# Altium project doppler.PrjPcb (part 2 of 2)

## Sheet 7_wallfilter.SchDoc
size A; SheetNumber: 7; SheetTotal: 7
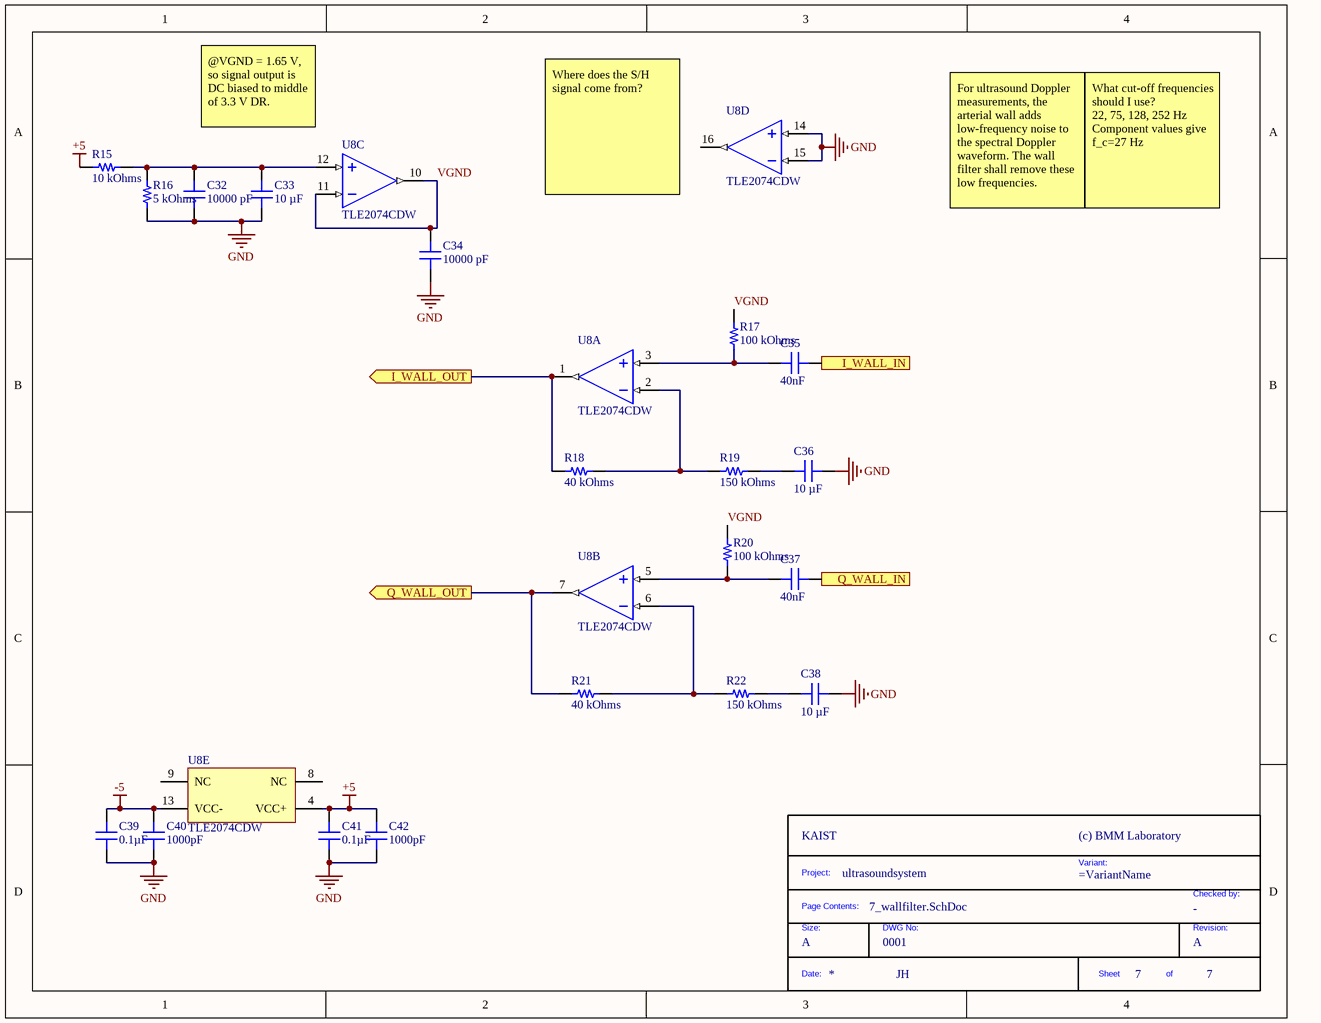
[diagram p4: 7_wallfilter.SchDoc]

### Parts
(Parts that share a designator on the sheet are numbered #1, #2 ... from top to bottom, then left to right.)
*?#5  DWG No: 0001  Size: A  (hidden comment: TitleBlock)  (graphical)
C32  10000 pF  [CAP 1206_3216 - 0.8MM]
C33  10 µF  [CAP 1206_3216 - 0.8MM]
C34  10000 pF  [CAP 1206_3216 - 0.8MM]
C35  40nF  [CAP 1206_3216 - 1.8MM]
C36  10 µF  [CAP 1206_3216 - 0.8MM]
C37  40nF  [CAP 1206_3216 - 1.8MM]
C38  10 µF  [CAP 1206_3216 - 0.8MM]
C39  0.1µF  [CAP 1206_3216 - 1.0MM]
C40  1000pF  [CAP 1206_3216 - 1.2MM]
C41  0.1µF  [CAP 1206_3216 - 1.0MM]
C42  1000pF  [CAP 1206_3216 - 1.2MM]
R15  10 kOhms  [RES 1206_3216]
R16  5 kOhms  [RES 1206_3216]
R17  100 kOhms  [RES 1206_3216]
R18  40 kOhms  [RES 1206_3216]
R19  150 kOhms  [RES 1206_3216]
R20  100 kOhms  [RES 1206_3216]
R21  40 kOhms  [RES 1206_3216]
R22  150 kOhms  [RES 1206_3216]
U8  TLE2074CDW  [DW0016A_M]  (parts A,B,C,D,E of 5)

### Ports
I_WALL_IN (in), I_WALL_OUT (out), Q_WALL_IN (in), Q_WALL_OUT (out)

### Nets
+5: C41.2 C42.2 R15.2 U8.4(VCC+)
-5: C39.2 C40.2 U8.13(VCC-)
GND: C32.1 C33.1 C34.1 C36.1 C38.1 C39.1 C40.1 C41.1 C42.1 R16.2 U8.14(IN4+) U8.15(IN4-)
VGND: C34.2 R17.2 R20.2 U8.10(OUT3) U8.11(IN3-)
NetC32_2: C32.2 C33.2 R15.1 R16.1 U8.12(IN3+)
NetC35_1: C35.1 ; port I_WALL_IN
NetC35_2: C35.2 R17.1 U8.3(IN1+)
NetC36_2: C36.2 R19.1
NetC37_1: C37.1 ; port Q_WALL_IN
NetC37_2: C37.2 R20.1 U8.5(IN2+)
NetC38_2: C38.2 R22.1
NetJ1_9: R18.2 U8.1(OUT1) ; port I_WALL_OUT
NetJ1_10: R21.2 U8.7(OUT2) ; port Q_WALL_OUT
NetR18_1: R18.1 R19.2 U8.2(IN1-)
NetR21_1: R21.1 R22.2 U8.6(IN2-)

Not connected (* = marked no-connect by the designer): U8 8(NC) 9(NC) 16(OUT4)

### Notes on the sheet
- @VGND = 1.65 V, so signal output is DC biased to middle of 3.3 V DR.
- (near U8) Where does the S/H signal come from?
- For ultrasound Doppler measurements, the arterial wall adds low-frequency noise to the spectral Doppler waveform. The wall filter shall remove these low frequencies.
- What cut-off frequencies should I use?
  22, 75, 128, 252 Hz
  Component values give f_c=27 Hz
- (in symbol TitleBlock) Project:; Variant:; Checked by:; Page Contents:; Size:; DWG No:; Revision:; Date:; Sheet; of

### Library data of the parts
*?#5 = TitleBlock: Standard Title Block; Checked by: -
C32 C34 = 1206B103K500CT: CAP CER 10000PF 50V X7R 1206; manufacturer: Walsin Technology Corporation; Tolerance: ±10%; Part Number: 1206B103K500CT; Value: 10000 pF; Applications: General Purpose; Capacitance: 10000 pF; componentlink1description: Datasheet; componentlink1url: http://www.passivecomponent.com/wp-content/uploads/2018/10/MLCC.pdf; componentlink2description: DigiKey Link; componentlink2url: https://www.digikey.com/en/products/detail/walsin-technology-corporation/1206B103K500CT/9355097; Device Package: 1206 (3216 Metric); lastupdated: 2023-04-30 19:15:57; Lifecycle Status: Active; Minimum Order: 1; Mounting Type: Surface Mount, MLCC; Operating Temperature: -55°C ~ 125°C; Package / Case: 1206 (3216 Metric); packaging: TapeAndReel; partid: 19113; Part Status: Active; price: 0.01; series: -; Size / Dimension: 0.126" L x 0.063" W (3.20mm x 1.60mm); Supplier 1: DigiKey; Supplier Part Number 1: 1292-1600-1-ND; Temperature Coefficient: X7R; Thickness (Max): 0.035" (0.90mm); Voltage - Rated: 50V
C33 C36 C38 = GRM31CR71E106KA12K: CAP CER 10UF 25V X7R 1206; manufacturer: Murata Electronics; Tolerance: ±10%; Part Number: GRM31CR71E106KA12K; Value: 10 µF; Applications: General Purpose; Capacitance: 10 µF; componentlink1description: Datasheet; componentlink1url: https://search.murata.co.jp/Ceramy/image/img/A01X/G101/ENG/GRM31CR71E106KA12-01.pdf; componentlink2description: DigiKey Link; componentlink2url: https://www.digikey.com/en/products/detail/murata-electronics/GRM31CR71E106KA12K/4905618; Device Package: 1206 (3216 Metric); lastupdated: 2023-04-30 19:16:01; Lifecycle Status: Active; Minimum Order: 1; Mounting Type: Surface Mount, MLCC; Operating Temperature: -55°C ~ 125°C; Package / Case: 1206 (3216 Metric); packaging: TapeAndReel; partid: 19493; Part Status: Active; price: 0.06; series: GRM; Size / Dimension: 0.126" L x 0.063" W (3.20mm x 1.60mm); Supplier 1: DigiKey; Supplier Part Number 1: 490-14678-1-ND; Temperature Coefficient: X7R; Thickness (Max): 0.071" (1.80mm); Voltage - Rated: 25V
C35 C37 = 12065C474JAT2A: CAP CER 0.47UF 50V X7R 1206; manufacturer: AVX Corporation; Capacitance: 0.47µF; Tolerance: ±5%; Part Number: 12065C474JAT2A; Value: 40nF; Applications: General Purpose; componentlink1description: Datasheet; componentlink1url: http://datasheets.avx.com/X7RDielectric.pdf; componentlink2description: DigiKey Link; componentlink2url: http://digikey.com/product-detail/en/avx-corporation/12065C474JAT2A/478-5784-1-ND/2136376; Device Package: 1206 (3216 Metric); lastupdated: 2020-09-02 01:05:40; Lifecycle Status: Active; Minimum Order: 1; Mounting Type: Surface Mount, MLCC; Operating Temperature: -55°C ~ 125°C; Package / Case: 1206 (3216 Metric); packaging: TapeAndReel; partid: 20070; Part Status: Active; price: 0.08; series: -; Size / Dimension: 0.126" L x 0.063" W (3.20mm x 1.60mm); Supplier 1: DigiKey; Supplier Part Number 1: 478-5784-1-ND; Temperature Coefficient: X7R; Thickness (Max): 0.060" (1.52mm); Voltage - Rated: 50V
C39 C41 = 12065C104JAT2A: CAP CER 0.1UF 50V X7R 1206; manufacturer: AVX Corporation; Tolerance: ±5%; Part Number: 12065C104JAT2A; Value: 0.1µF; Applications: General Purpose; Capacitance: 0.1µF; componentlink1description: Datasheet; componentlink1url: http://datasheets.avx.com/X7RDielectric.pdf; componentlink2description: DigiKey Link; componentlink2url: http://digikey.com/product-detail/en/avx-corporation/12065C104JAT2A/478-3797-1-ND/1116495; Device Package: 1206 (3216 Metric); lastupdated: 2020-09-02 01:05:06; Lifecycle Status: Active; Minimum Order: 1; Mounting Type: Surface Mount, MLCC; Operating Temperature: -55°C ~ 125°C; Package / Case: 1206 (3216 Metric); packaging: TapeAndReel; partid: 19088; Part Status: Active; price: 0.06; series: -; Size / Dimension: 0.126" L x 0.063" W (3.20mm x 1.60mm); Supplier 1: DigiKey; Supplier Part Number 1: 478-3797-1-ND; Temperature Coefficient: X7R; Thickness (Max): 0.037" (0.94mm); Voltage - Rated: 50V
C40 C42 = 12067C102KAT2A: CAP CER 1000PF 500V X7R 1206; manufacturer: AVX Corporation; Tolerance: ±10%; Part Number: 12067C102KAT2A; Value: 1000pF; Applications: General Purpose; Capacitance: 1000pF; componentlink1description: Datasheet; componentlink1url: http://datasheets.avx.com/X7RDielectric.pdf; componentlink2description: DigiKey Link; componentlink2url: http://digikey.com/product-detail/en/avx-corporation/12067C102KAT2A/478-3805-1-ND/1116503; Device Package: 1206 (3216 Metric); lastupdated: 2020-09-02 01:05:09; Lifecycle Status: Active; Minimum Order: 1; Mounting Type: Surface Mount, MLCC; Operating Temperature: -55°C ~ 125°C; Package / Case: 1206 (3216 Metric); packaging: TapeAndReel; partid: 19161; Part Status: Active; price: 0.09; series: -; Size / Dimension: 0.126" L x 0.063" W (3.20mm x 1.60mm); Supplier 1: DigiKey; Supplier Part Number 1: 478-3805-1-ND; Temperature Coefficient: X7R; Thickness (Max): 0.040" (1.02mm); Voltage - Rated: 500V
R15 = CRG1206F10K: RES SMD 10K OHM 1% 1/4W 1206; Manufacturer: TE Connectivity Passive Product; Power (Watts): 0.25W, 1/4W; Temperature Coefficient: ±100ppm/°C; Part Number: CRG1206F10K; ComponentLink1Description: Datasheet; ComponentLink1URL: https://www.te.com/commerce/DocumentDelivery/DDEController?Action=srchrtrv&DocNm=1773204&DocType=DS&DocLang=English; ComponentLink2Description: DigiKey Link; ComponentLink2URL: https://www.digikey.com/en/products/detail/te-connectivity-passive-product/CRG1206F10K/2389909; Composition: Thick Film; Device Package: 1206 (3216 Metric); Height - Seated (Max): 0.026" (0.65mm); LastUpdated: 2023-04-30 19:43:59; Lifecycle Status: Active; Minimum Order: 1; Number of Terminations: 2; Operating Temperature: -55°C ~ 155°C; Package / Case: 1206 (3216 Metric); Packaging: TapeAndReel; PartId: 26989; Part Status: Active; Price: 0.01; Resistance: 10 kOhms; Series: CRG, Neohm; Size / Dimension: 0.122" L x 0.061" W (3.10mm x 1.55mm); Supplier 1: DigiKey; Supplier Part Number 1: A106069CT-ND; Supplier Device Package: 1206; Tolerance: ±1%; Value: 10 kOhms
R16 = RT1206BRD075KL: RES SMD 5K OHM 0.1% 1/4W 1206; Manufacturer: Yageo; Power (Watts): 0.25W, 1/4W; Temperature Coefficient: ±25ppm/°C; Part Number: RT1206BRD075KL; ComponentLink1Description: Datasheet; ComponentLink1URL: https://www.yageo.com/upload/media/product/productsearch/datasheet/rchip/PYu-RT_1-to-0.01_RoHS_L_11.pdf; ComponentLink2Description: DigiKey Link; ComponentLink2URL: https://www.digikey.com/en/products/detail/yageo/RT1206BRD075KL/5936961; Composition: Thin Film; Device Package: 1206 (3216 Metric); Height - Seated (Max): 0.026" (0.65mm); LastUpdated: 2023-04-30 19:43:23; Lifecycle Status: Active; Minimum Order: 1; Number of Terminations: 2; Operating Temperature: -55°C ~ 155°C; Package / Case: 1206 (3216 Metric); Packaging: TapeAndReel; PartId: 33949; Part Status: Active; Price: 0.09; Resistance: 5 kOhms; Series: RT; Size / Dimension: 0.122" L x 0.063" W (3.10mm x 1.60mm); Supplier 1: DigiKey; Supplier Part Number 1: YAG5090CT-ND; Supplier Device Package: 1206; Tolerance: ±0.1%; Value: 5 kOhms
R17 R20 = CRGCQ1206F100K: RES 100K OHM 1% 1/4W 1206; Manufacturer: TE Connectivity Passive Product; Power (Watts): 0.25W, 1/4W; Temperature Coefficient: ±100ppm/°C; Part Number: CRGCQ1206F100K; ComponentLink1Description: Datasheet; ComponentLink1URL: https://www.te.com/commerce/DocumentDelivery/DDEController?Action=srchrtrv&DocNm=1773204-3&DocType=DS&DocLang=English; ComponentLink2Description: DigiKey Link; ComponentLink2URL: https://www.digikey.com/en/products/detail/te-connectivity-passive-product/CRGCQ1206F100K/8576436; Composition: Thick Film; Device Package: 1206 (3216 Metric); Features: Automotive AEC-Q200, Moisture Resistant; Height - Seated (Max): 0.026" (0.65mm); LastUpdated: 2023-04-30 19:43:59; Lifecycle Status: Active; Minimum Order: 1; Number of Terminations: 2; Operating Temperature: -55°C ~ 155°C; Package / Case: 1206 (3216 Metric); Packaging: TapeAndReel; PartId: 26994; Part Status: Active; Price: 0.01; Ratings: AEC-Q200; Resistance: 100 kOhms; Series: CRGCQ; Size / Dimension: 0.122" L x 0.061" W (3.10mm x 1.55mm); Supplier 1: DigiKey; Supplier Part Number 1: A129834CT-ND; Supplier Device Package: 1206; Tolerance: ±1%; Value: 100 kOhms
R18 R21 = RT1206BRD0740KL: RES SMD 40K OHM 0.1% 1/4W 1206; Manufacturer: Yageo; Power (Watts): 0.25W, 1/4W; Temperature Coefficient: ±25ppm/°C; Part Number: RT1206BRD0740KL; ComponentLink1Description: Datasheet; ComponentLink1URL: https://www.yageo.com/upload/media/product/productsearch/datasheet/rchip/PYu-RT_1-to-0.01_RoHS_L_12.pdf; ComponentLink2Description: DigiKey Link; ComponentLink2URL: https://www.digikey.com/en/products/detail/yageo/RT1206BRD0740KL/5936957; Composition: Thin Film; Device Package: 1206 (3216 Metric); Height - Seated (Max): 0.026" (0.65mm); LastUpdated: 2023-04-30 19:42:13; Lifecycle Status: Active; Minimum Order: 1; Number of Terminations: 2; Operating Temperature: -55°C ~ 155°C; Package / Case: 1206 (3216 Metric); Packaging: TapeAndReel; PartId: 58355; Part Status: Active; Price: 0.09; Resistance: 40 kOhms; Series: RT; Size / Dimension: 0.122" L x 0.063" W (3.10mm x 1.60mm); Supplier 1: DigiKey; Supplier Part Number 1: 13-RT1206BRD0740KLCT-ND; Supplier Device Package: 1206; Tolerance: ±0.1%; Value: 40 kOhms
R19 R22 = CR1206-FX-1503ELF: RES SMD 150K OHM 1% 1/4W 1206; Manufacturer: Bourns Inc.; Power (Watts): 0.25W, 1/4W; Temperature Coefficient: ±100ppm/°C; Part Number: CR1206-FX-1503ELF; ComponentLink1Description: Datasheet; ComponentLink1URL: https://www.bourns.com/docs/Product-Datasheets/CHPREZTR.pdf; ComponentLink2Description: DigiKey Link; ComponentLink2URL: https://www.digikey.com/en/products/detail/bourns-inc/CR1206-FX-1503ELF/2562775; Composition: Thick Film; Device Package: 1206 (3216 Metric); Features: Moisture Resistant; Height - Seated (Max): 0.030" (0.75mm); LastUpdated: 2023-04-30 19:43:43; Lifecycle Status: Active; Minimum Order: 1; Number of Terminations: 2; Operating Temperature: -55°C ~ 155°C; Package / Case: 1206 (3216 Metric); Packaging: TapeAndReel; PartId: 29549; Part Status: Active; Price: 0.01; Resistance: 150 kOhms; Series: CR1206; Size / Dimension: 0.126" L x 0.063" W (3.20mm x 1.60mm); Supplier 1: DigiKey; Supplier Part Number 1: CR1206-FX-1503ELFCT-ND; Supplier Device Package: 1206; Tolerance: ±1%; Value: 150 kOhms
U8 = CMP-0272-03500-3: Quad Low-Noise High-Speed JFET-Input Operational Amplifier, 4.5 to 38 V, 0 to 70 degC, 16-pin SOIC (DW16), Green (RoHS & no Sb/Br); Manufacturer: Texas Instruments; GBW(Typ)(MHz): 9.4; Number of Channels: 4; Total Supply Voltage(Min)(+5V is 5, +/-5V is 10): 4.5; Slew Rate(Typ)(V/us): 35; Sub Family: High Output Current Amplifier (>=50mA), High Supply Voltage Amplifier (>=30V), Precision Amplifier; IIB(Max)(pA): 175; Vio (25C)(Max)(mV): 5; Iq per channel(Max)(mA): 1.875; Offset Drift(Typ)(uV/C): 10.1; CMRR(Min)(dB): 70; Total Supply Voltage(Max)(+5V is 5, +/-5V is 10): 38; Packing: TUBE; Rating: Catalog; PartNumber: TLE2074CDW; ComponentLink3URL: http://www.ti.com/litv/pdf/msoi003g; Eco-Plan: Green (RoHS & no Sb/Br); PackageDescription: 16-Pin Plastic Small Outline, Body 10.30 x 7.50 mm, Pitch 1.27 mm; Mounting Technology: Surface Mount; Code_JEDEC: MS-013; ComponentLink2URL: http://www.ti.com/lit/ds/symlink/tle2074.pdf; PackageVersion: 4040000-2/G, 01/2011; PackageReference: DW0016A; ComponentLink1URL: http://www.ti.com/; ComponentLink3Description: Package Specification; DatasheetVersion: SLOS181C; ComponentLink1Description: Manufacturer URL; ComponentLink2Description: Datasheet

## Sheet 3_bp_filter.SchDoc
size A; SheetNumber: 4; SheetTotal: 7
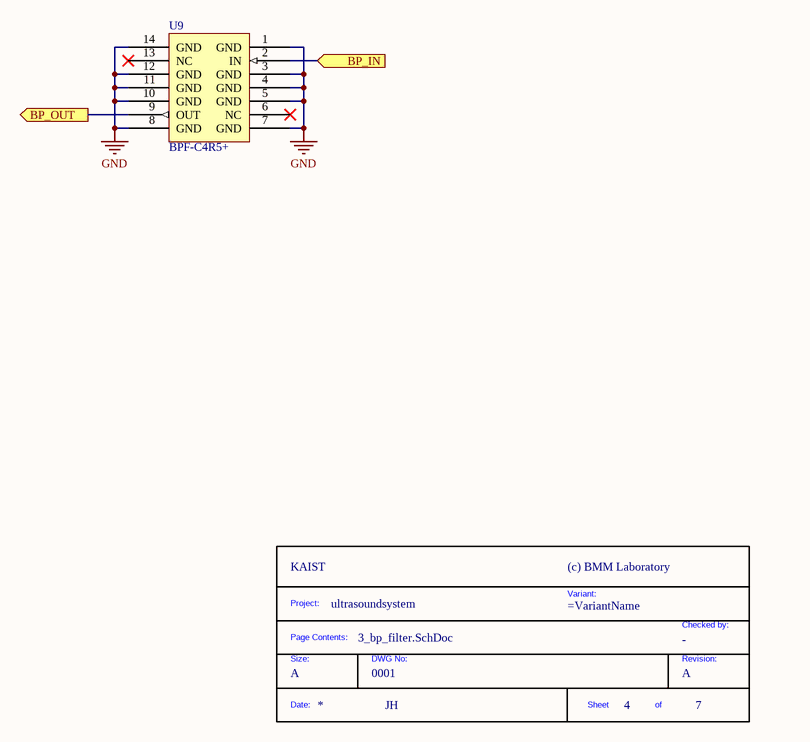
[diagram p5: 3_bp_filter.SchDoc]

### Parts
(Parts that share a designator on the sheet are numbered #1, #2 ... from top to bottom, then left to right.)
*?#6  DWG No: 0001  Size: A  (hidden comment: TitleBlock)  (graphical)
U9  BPF-C4R5+  [BPF-C4R5+-Footprint-1]

### Ports
BP_IN (in), BP_OUT (out)

### Nets
GND: U9.1(GND) U9.3(GND) U9.4(GND) U9.5(GND) U9.7(GND) U9.8(GND) U9.10(GND) U9.11(GND) U9.12(GND) U9.14(GND)
NetA3_S: U9.2(IN) ; port BP_IN
NetU3_3: U9.9(OUT) ; port BP_OUT

Not connected (* = marked no-connect by the designer): U9 6(NC)* 13(NC)*

### Notes on the sheet
- (in symbol TitleBlock) Project:; Variant:; Checked by:; Page Contents:; Size:; DWG No:; Revision:; Date:; Sheet; of

### Library data of the parts
*?#6 = TitleBlock: Standard Title Block; Checked by: -
U9 = CMP-00025-00003-2: Rf Filter Band Pass 4.5MHZ 14SMD; Supplier 1: Mouser

## Sheet 6_sha.SchDoc
size A; SheetNumber: 6; SheetTotal: 7
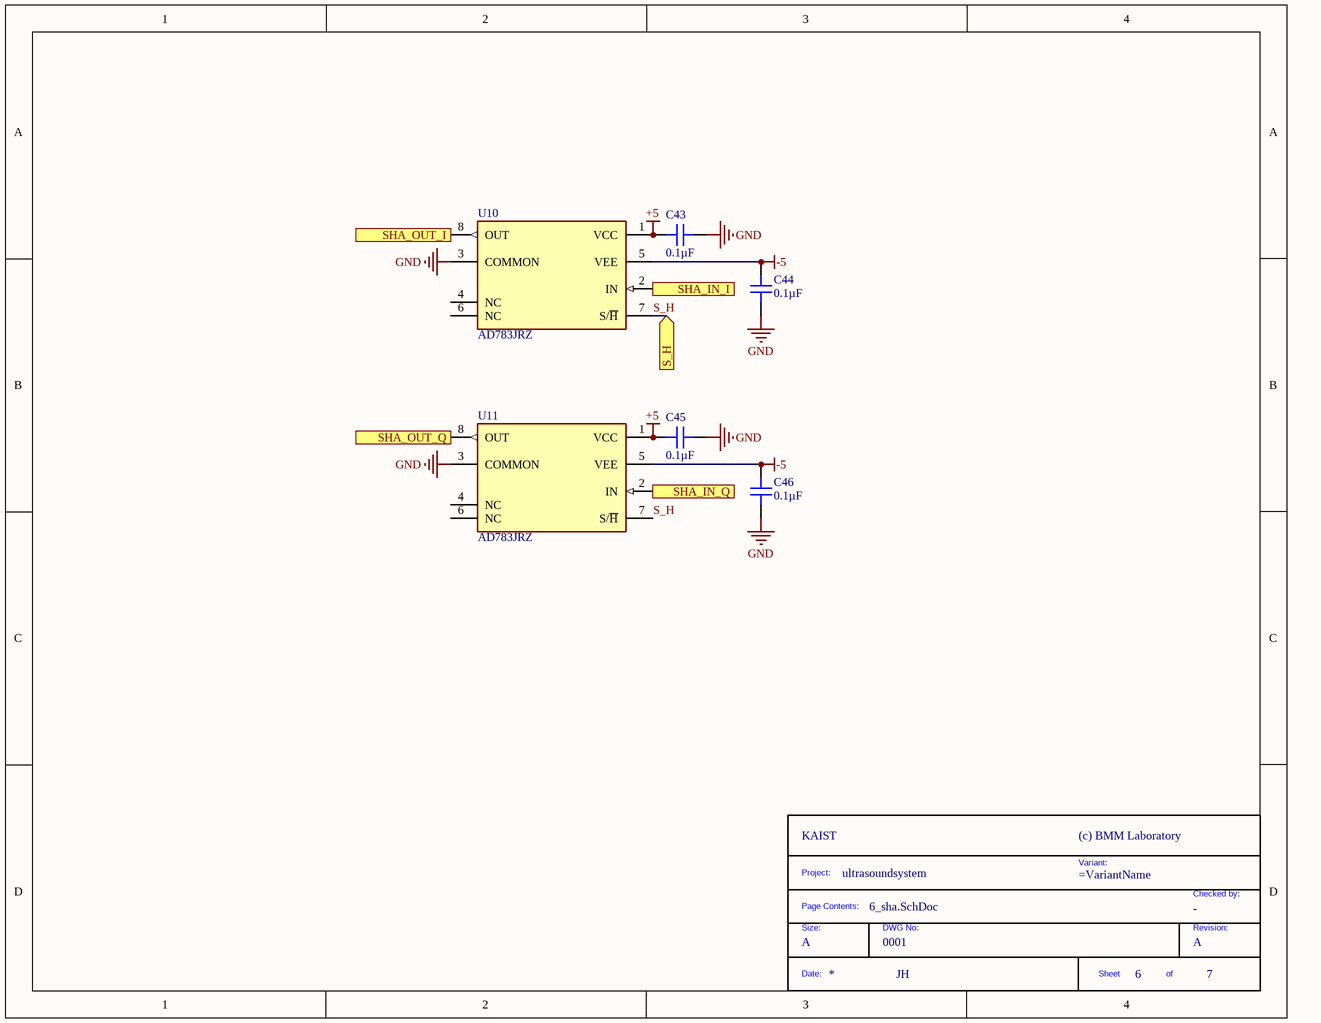
[diagram p6: 6_sha.SchDoc]

### Parts
(Parts that share a designator on the sheet are numbered #1, #2 ... from top to bottom, then left to right.)
*?#7  DWG No: 0001  Size: A  (hidden comment: TitleBlock)  (graphical)
C43  0.1µF  [CAP 1206_3216 - 1.0MM]
C44  0.1µF  [CAP 1206_3216 - 1.0MM]
C45  0.1µF  [CAP 1206_3216 - 1.0MM]
C46  0.1µF  [CAP 1206_3216 - 1.0MM]
U10  AD783JRZ  [FP-R-8-IPC_B]
U11  AD783JRZ  [FP-R-8-IPC_B]

### Ports
S_H (in), SHA_IN_I (in), SHA_IN_Q (in), SHA_OUT_I (out), SHA_OUT_Q (out)

### Nets
+5: C43.1 C45.1 U10.1(VCC) U11.1(VCC)
-5: C44.2 C46.1 U10.5(VEE) U11.5(VEE)
GND: C43.2 C44.1 C45.2 C46.2 U10.3(COMMON) U11.3(COMMON)
S_H: U10.7(S/~{H}) U11.7(S/~{H}) ; port S_H
NetC35_1: U10.8(OUT) ; port SHA_OUT_I
NetC37_1: U11.8(OUT) ; port SHA_OUT_Q
NetU5_6: U10.2(IN) ; port SHA_IN_I
NetU6_6: U11.2(IN) ; port SHA_IN_Q

Not connected (* = marked no-connect by the designer): U10 4(NC) 6(NC); U11 4(NC) 6(NC)

### Notes on the sheet
- (in symbol TitleBlock) Project:; Variant:; Checked by:; Page Contents:; Size:; DWG No:; Revision:; Date:; Sheet; of

### Library data of the parts
*?#7 = TitleBlock: Standard Title Block; Checked by: -
C43-C46 = 12065C104JAT2A: as C39 on sheet 7_wallfilter; Part Number: 12065C104JAT2A; Value: 0.1µF; Applications: General Purpose; Capacitance: 0.1µF; componentlink1description: Datasheet; componentlink1url: http://datasheets.avx.com/X7RDielectric.pdf; componentlink2description: DigiKey Link; componentlink2url: http://digikey.com/product-detail/en/avx-corporation/12065C104JAT2A/478-3797-1-ND/1116495; Device Package: 1206 (3216 Metric); lastupdated: 2020-09-02 01:05:06; Lifecycle Status: Active; Minimum Order: 1; Mounting Type: Surface Mount, MLCC; Operating Temperature: -55°C ~ 125°C; Package / Case: 1206 (3216 Metric); packaging: TapeAndReel; partid: 19088; Part Status: Active; price: 0.06; series: -; Size / Dimension: 0.126" L x 0.063" W (3.20mm x 1.60mm); Supplier 1: DigiKey; Supplier Part Number 1: 478-3797-1-ND; Temperature Coefficient: X7R; Thickness (Max): 0.037" (0.94mm); Voltage - Rated: 50V
U10 U11 = CMP-09116-000396-1: IC SAMPL/HOLD 1 CIRCUIT 8SOIC; Operating Supply Current: 9.5mA; Settling Time: 150ns; Dual Supply Voltage: 5V; Input Offset Voltage (Vos): 50mV; Number of Circuits: 1; -3db Bandwidth: 15MHz; Output Current per Channel: 5mA; Max Supply Voltage: 5.25V; Input Bias Current: 100nA; Min Supply Voltage: 4.75V; RoHS Compliant: Yes; Max Operating Temperature: 70°C; Mount: Surface Mount; REACH SVHC: No SVHC; Min Operating Temperature: 0°C; Case/Package: SOIC; Number of Amplifiers: 1; Height: 2.45mm; Contact Plating: Tin; Bandwidth: 15MHz; Lead Free: Contains Lead; Number of Pins: 8; Width: 4.01mm; Number of Channels: 1; Length: 5mm; Package Quantity: 1; Series: -; Max Dual Supply Voltage: 5.25V; Min Dual Supply Voltage: 4.75V; Operating Supply Voltage: 5V; Packaging: Rail/Tube

## Nets that join several sheets
+5: 2_powerstage (C1.2 U1.8 U1.10 U1.11), 4_preamp (C7.2 C8.2 L1.1 U3.2), 5_demodulation (12 pins), 7_wallfilter (C41.2 C42.2 R15.2 U8.4), 6_sha (C43.1 C45.1 U10.1 U11.1)
-5: 2_powerstage (C6.2 U1.2 U1.5 U1.6), 4_preamp (C18.2 C19.2 U3.6), 5_demodulation (5 pins), 7_wallfilter (C39.2 C40.2 U8.13), 6_sha (C44.2 C46.1 U10.5 U11.5)
GND: 1_toplevel (5 pins), 2_powerstage (5 pins), 4_preamp (25 pins), 5_demodulation (26 pins), 7_wallfilter (12 pins), 3_bp_filter (10 pins), 6_sha (6 pins)
NetA2_S: 1_toplevel (A2.S), 2_powerstage (D1.3)
NetA3_S: 1_toplevel (A3.S), 3_bp_filter (U9.2)
NetC29_2: 1_toplevel (J2.1), 5_demodulation (C29.2)
NetC30_2: 1_toplevel (J2.2), 5_demodulation (C30.2)
NetC31_2: 1_toplevel (J1.6), 5_demodulation (C31.2 R11.1)
NetC35_1: 7_wallfilter (C35.1), 6_sha (U10.8)
NetC37_1: 7_wallfilter (C37.1), 6_sha (U11.8)
NetJ1_1: 1_toplevel (J1.1), 2_powerstage (U1.1)
NetJ1_3: 1_toplevel (J1.3), 2_powerstage (U1.3)
NetJ1_5: 1_toplevel (J1.5), 2_powerstage (U1.12)
NetJ1_9: 1_toplevel (J1.9), 7_wallfilter (R18.2 U8.1)
NetJ1_10: 1_toplevel (J1.10), 7_wallfilter (R21.2 U8.7)
NetR3_2: 4_preamp (U2.23), 5_demodulation (R3.2)
NetR4_2: 4_preamp (U2.22), 5_demodulation (R4.2)
NetU3_3: 4_preamp (U3.3), 3_bp_filter (U9.9)
NetU5_6: 5_demodulation (U5.6), 6_sha (U10.2)
NetU6_6: 5_demodulation (U6.6), 6_sha (U11.2)
S_H: 1_toplevel (J1.8), 6_sha (U10.7 U11.7)